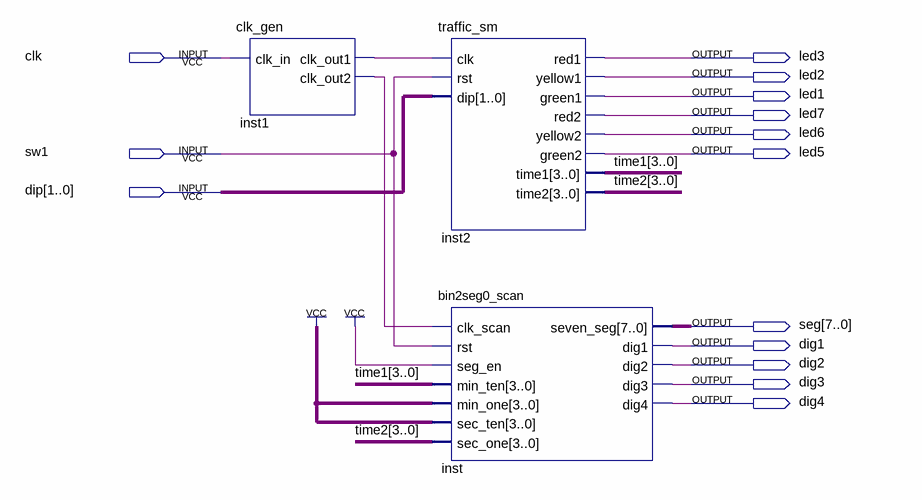
[diagram p0: schematic sheet]
// Quartus schematic traffic.bdf as structural Verilog: 3 symbols, 14 pins
module traffic (
  input  clk,
  input  sw1,
  input  [1:0] dip,
  output led3,
  output led2,
  output led1,
  output led7,
  output led6,
  output led5,
  output [7:0] seg,
  output dig1,
  output dig2,
  output dig3,
  output dig4
);

  wire inst1_clk_out1, inst1_clk_out2;
  wire [3:0] time1, time2;

  clk_gen inst1 (.clk_in(clk), .clk_out1(inst1_clk_out1), .clk_out2(inst1_clk_out2));
  traffic_sm inst2 (
    .clk(inst1_clk_out1), .rst(sw1), .dip(dip), .red1(led3), .yellow1(led2), .green1(led1), .red2(led7),
    .yellow2(led6), .green2(led5), .time1(time1), .time2(time2));
  bin2seg0_scan inst (
    .clk_scan(inst1_clk_out2), .rst(sw1), .seg_en(1'b1), .min_ten(time1), .min_one(4'b1111),
    .sec_ten(4'b1111), .sec_one(time2), .seven_seg(seg), .dig1(dig1), .dig2(dig2), .dig3(dig3), .dig4(dig4));
endmodule
